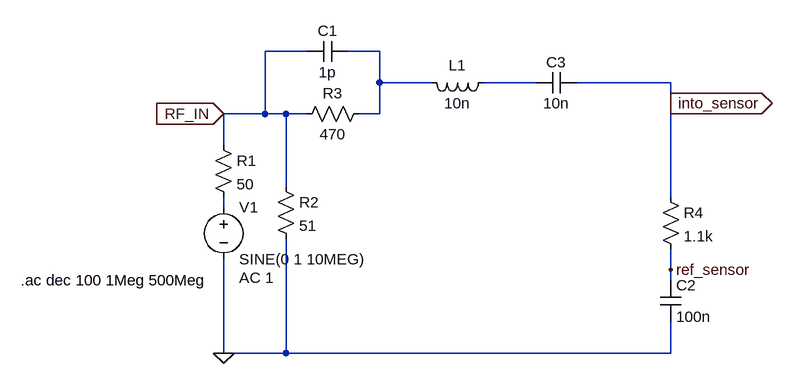
[diagram p0: schematic simulating_equalization_in_sensor.asc]
simulating_equalization_in_sensor.asc, the LTspice schematic file:
Version 4
SHEET 1 880 680
WIRE 128 -128 64 -128
WIRE 240 -128 192 -128
WIRE 240 -80 240 -128
WIRE 320 -80 240 -80
WIRE 480 -80 400 -80
WIRE 688 -80 544 -80
WIRE 688 -48 688 -80
WIRE 64 -32 64 -128
WIRE 64 -32 0 -32
WIRE 96 -32 64 -32
WIRE 128 -32 96 -32
WIRE 240 -32 240 -80
WIRE 240 -32 208 -32
WIRE 0 16 0 -32
WIRE 96 80 96 -32
WIRE 688 96 688 -48
WIRE 0 112 0 96
WIRE 688 208 688 176
WIRE 688 224 688 208
WIRE 0 336 0 192
WIRE 96 336 96 160
WIRE 96 336 0 336
WIRE 688 336 688 288
WIRE 688 336 96 336
FLAG 0 336 0
FLAG 688 -48 into_sensor
IOPIN 688 -48 Out
FLAG 0 -32 RF_IN
IOPIN 0 -32 In
FLAG 688 208 ref_sensor
SYMBOL voltage 0 96 R0
WINDOW 123 24 124 Left 2
WINDOW 39 0 0 Left 0
SYMATTR InstName V1
SYMATTR Value SINE(0 1 10MEG)
SYMATTR Value2 AC 1
SYMBOL res -16 0 R0
SYMATTR InstName R1
SYMATTR Value 50
SYMBOL res 224 -48 R90
WINDOW 0 0 56 VBottom 2
WINDOW 3 32 56 VTop 2
SYMATTR InstName R3
SYMATTR Value 470
SYMBOL cap 192 -144 R90
WINDOW 0 0 32 VBottom 2
WINDOW 3 32 32 VTop 2
SYMATTR InstName C1
SYMATTR Value 1p
SYMBOL ind 416 -96 R90
WINDOW 0 5 56 VBottom 2
WINDOW 3 32 56 VTop 2
SYMATTR InstName L1
SYMATTR Value 10n
SYMBOL res 672 80 R0
SYMATTR InstName R4
SYMATTR Value 1.1k
SYMBOL cap 544 -96 R90
WINDOW 0 0 32 VBottom 2
WINDOW 3 32 32 VTop 2
SYMATTR InstName C3
SYMATTR Value 10n
SYMBOL res 80 64 R0
SYMATTR InstName R2
SYMATTR Value 51
SYMBOL cap 672 224 R0
SYMATTR InstName C2
SYMATTR Value 100n
TEXT -312 224 Left 2 !.ac dec 100 1Meg 500Meg

The netlist it stands for:
* simulating_equalization_in_sensor.asc
V1 N003 0 SINE(0 1 10MEG) AC 1
R1 RF_IN N003 50
R3 N001 RF_IN 470
C1 N001 RF_IN 1p
L1 N002 N001 10n
R4 into_sensor ref_sensor 1.1k
C3 into_sensor N002 10n
R2 RF_IN 0 51
C2 ref_sensor 0 100n
.ac dec 100 1Meg 500Meg
.backanno
.end